# EAGLE design USB LiPo charger (EAGLE 5.06)
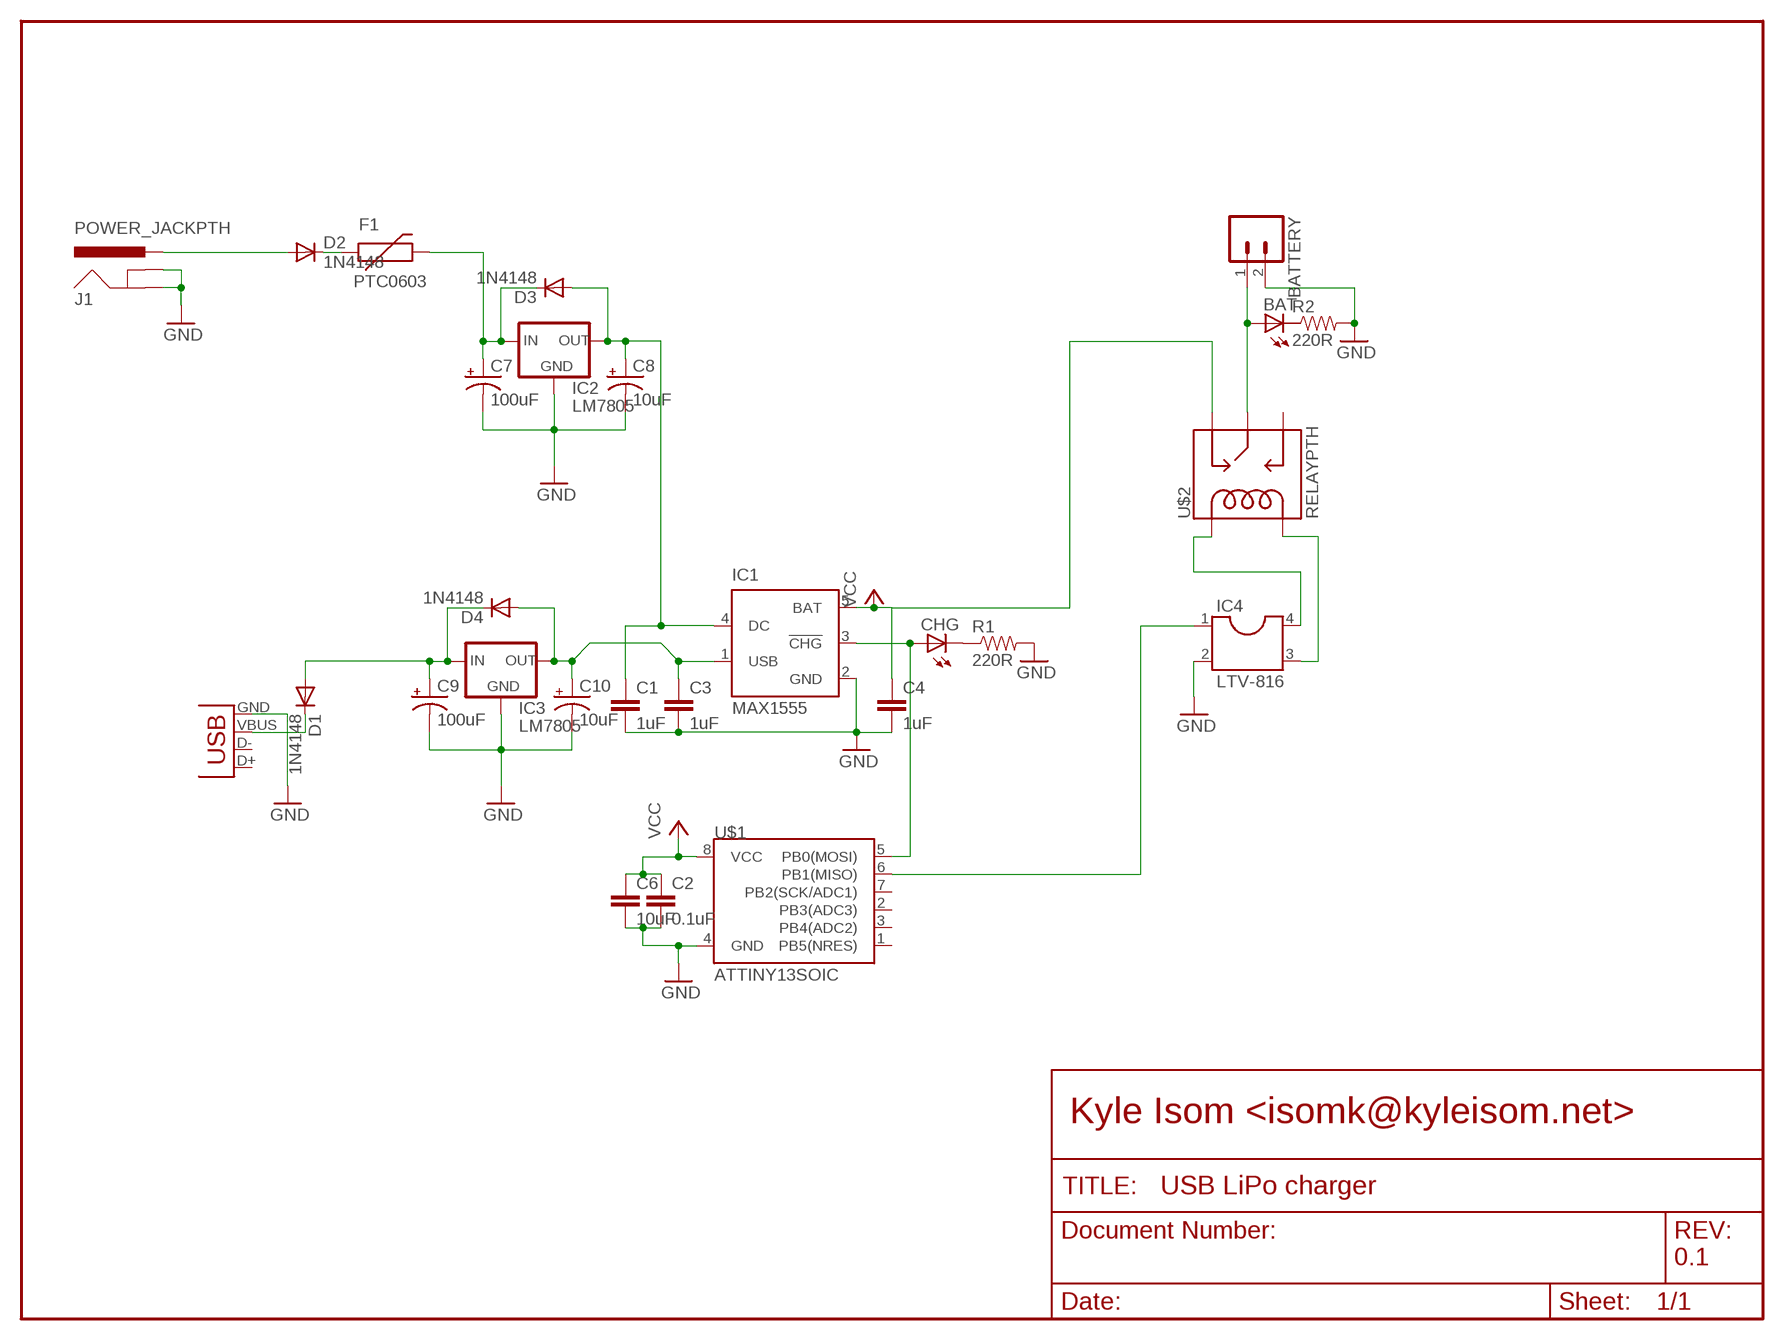
[diagram p0: schematic, sheet 1]

## Parts
BAT  LEDCHIP-LED0603  [CHIP-LED0603]
BATTERY  M02-JST-2MM-SMT  [S2B-PH]
C1  1uF  CAP0603-CAP  [0603-CAP]
C2  0.1uF  CAP0603-CAP  [0603-CAP]
C3  1uF  CAP0603-CAP  [0603-CAP]
C4  1uF  CAP0603-CAP  [0603-CAP]
C6  10uF  CAP0603-CAP  [0603-CAP]
C7  100uF  CAP_POL1206  [EIA3216]
C8  10uF  CAP_POL1206  [EIA3216]
C9  100uF  CAP_POL1206  [EIA3216]
C10  10uF  CAP_POL1206  [EIA3216]
CHG  LEDCHIP-LED0603  [CHIP-LED0603]
D1  1N4148  DIODESOD  [SOD-323]
D2  1N4148  DIODESOD  [SOD-323]
D3  1N4148  DIODE-SOD323-W  [SOD323-W]
D4  1N4148  DIODESOD  [SOD-323]
F1  PTC0603  [0603]
IC1  MAX1555  [SOT23-5L]
IC2  LM7805  V_REG_78XXSINK  [TO220-IGO]
IC3  LM7805  V_REG_78XXSINK  [TO220-IGO]
IC4  LTV-816  DIL4  [DIL04]
J1  POWER_JACKPTH  [POWER_JACK_PTH]
R1  220R  RESISTOR0603-RES  [0603-RES]
R2  220R  RESISTOR0603-RES  [0603-RES]
U$1  ATTINY13SOIC  [SO08]
U$2  RELAYPTH  [RELAY-G5Q]
X1  USBSMD  [USB-MINIB]

## Nets
GND: BATTERY.2 C1.2 C2.2 C3.2 C4.2 C6.2 C7.C(-) C8.C(-) C9.C(-) C10.C(-) IC1.2(GND) IC2.GND IC3.GND IC4.2 J1.GND J1.GNDBREAK R1.2 R2.2 U$1.4(GND) X1.GND
N$1: D2.2(A) J1.PWR
N$2: C3.1 C10.A(+) D4.2(A) IC1.1(USB) IC3.OUT
N$3: D1.1(C) X1.VBUS
N$5: C7.A(+) D3.C F1.2 IC2.IN
N$6: D2.1(C) F1.1
N$7: C9.A(+) D1.2(A) D4.1(C) IC3.IN
N$8: C1.1 C8.A(+) D3.A IC1.4(DC) IC2.OUT
N$9: CHG.A IC1.3(!CHG) U$1.5(PB0(MOSI))
N$10: CHG.C R1.1
N$11: IC4.1 U$1.6(PB1(MISO))
N$12: IC4.4 U$2.5(COIL1)
N$13: IC4.3 U$2.1(COIL2)
N$14: BAT.A BATTERY.1 U$2.2(MAIN)
VCC: C2.1 C4.1 C6.1 IC1.5(BAT) U$1.8(VCC) U$2.4(NC)
Unconnected: BAT.C R2.1 U$1.1(PB5(NRES)) U$1.2(PB3(ADC3)) U$1.3(PB4(ADC2)) U$1.7(PB2(SCK/ADC1)) U$2.3(NO) X1.D+ X1.D-

## Notes on the sheet
- Kyle Isom <isomk@kyleisom.net>
- 0.1

## Library data of the parts
BAT CHG = led:LED: LED OSRAM: - CHIPLED LG R971, LG N971, LY N971, LG Q971, LY Q971, LO R971, LY R971 LH N974, LH R974 LS Q976, LO Q976, LY Q976 LO Q996 - Hyper CHIPLED LW Q18S LB Q993, LB Q99A, LB R99A - SideLED LS A670, LO A670, LY A670, LG A670, LP A670 LB A673, LV A673, LT A673, LW A673 LH A674 LY A675 LS A676, LA A676, LO A676, LY A676, LW A676 LS A679, LY A679, LG A679 - Hyper Micro SIDELED® LS Y876, LA Y876, LO Y876, LY Y876 LT Y87S - SmartLED LW L88C, LW L88S LB L89C, LB L89S, LG L890 LS L89K, LO L89K, LY L89K LS L896, LA L896, LO L896, LY L896 - TOPLED LS T670, LO T670, LY T670, LG T670, LP T670 LSG T670, LSP T670, LSY T670, LOP T670, LYG T670 LG T671, LOG T671, LSG T671 LB T673, LV T673, LT T673, LW T673 LH T674 LS T676, LA T676, LO T676, LY T676, LB T676, LH T676, LSB T676, LW T676 LB T67C, LV T67C, LT T67C, LS T67K, LO T67K, LY T67K, LW E67C LS E67B, LA E67B, LO E67B, LY E67B, LB E67C, LV E67C, LT E67C LW T67C LS T679, LY T679, LG T679 LS T770, LO T770, LY T770, LG T770, LP T770 LB T773, LV T773, LT T773, LW T773 LH T774 LS E675, LA E675, LY E675, LS T675 LS T776, LA T776, LO T776, LY T776, LB T776 LHGB T686 LT T68C, LB T68C - Hyper Mini TOPLED® LB M676 - Mini TOPLED Santana® LG M470 LS M47K, LO M47K, LY M47K Source: http://www.osram.convergy.de LUXEON: - LUMILED® LXK2-PW12-R00, LXK2-PW12-S00, LXK2-PW14-U00, LXK2-PW14-V00 LXK2-PM12-R00, LXK2-PM12-S00, LXK2-PM14-U00 LXK2-PE12-Q00, LXK2-PE12-R00, LXK2-PE12-S00, LXK2-PE14-T00, LXK2-PE14-U00 LXK2-PB12-K00, LXK2-PB12-L00, LXK2-PB12-M00, LXK2-PB14-N00, LXK2-PB14-P00, LXK2-PB14-Q00 LXK2-PR12-L00, LXK2-PR12-M00, LXK2-PR14-Q00, LXK2-PR14-R00 LXK2-PD12-Q00, LXK2-PD12-R00, LXK2-PD12-S00 LXK2-PH12-R00, LXK2-PH12-S00 LXK2-PL12-P00, LXK2-PL12-Q00, LXK2-PL12-R00 Source: www.luxeon.com KINGBRIGHT: KA-3528ASYC Source: www.kingbright.com
BATTERY = SparkFun:M02: Header 2 Standard 2-pin 0.1" header. Use with straight break away headers (SKU : PRT-00116), right angle break away headers (PRT-00553), swiss pins (PRT-00743), machine pins (PRT-00117), and female headers (PRT-00115). Molex polarized connector foot print use with SKU : PRT-08233 with associated crimp pins and housings.
C1-C4 C6 = SparkFun:CAP: Capacitor Standard 0603 ceramic capacitor, and 0.1" leaded capacitor.
C7-C10 = SparkFun:CAP_POL: Capacitor Polarized These are standard SMD and PTH capacitors. Normally 10uF, 47uF, and 100uF in electrolytic and tantalum varieties. Always verify the external diameter of the through hole cap, it varies with capacity, voltage, and manufacturer. The EIA devices should be standard.
D1 D2 D4 = SparkFun:DIODE: Diode These are standard reverse protection diodes and small signal diodes. SMA package can handle up to about 1A. SOD-323 can handle about 200mA. What the SOD-323 package when ordering, there are some mfgs out there that are 5-pin packages.
D3 = diode:DIODE-: DIODE
F1 = SparkFun:PTC: Resettable Fuse PTC Resettable Fuse. Spark Fun Electronics SKU : COM-08357
IC1 = maxim:MAX1555: Dual-Input USB/AC Adapter 1-Cell Li+ Battery Chargers Source: http://www.maxim-ic.com .. MAX1551-MAX1555.pdf
IC2 IC3 = SparkFun:V_REG_78XX: Voltage Regulator Standard 7805 5V regulator. IGO (Input Ground Output). Spark Fun Electronics SKU : COM-00107
IC4 = ic-package:DIL4: Dual In Line / Socket
J1 = SparkFun:POWER_JACK: Power Jack This is the standard 5.5mm barrel jack for power. The PTH is the most common, proven, reliable, footprint. All others are experimental. The Slot footprint only works if the mill layer is transmitted to the PCB fab house so be warned. Spark Fun Electronics SKU : PRT-00119. Mating wall wart : TOL-00298 (and others)
R1 R2 = SparkFun:RESISTOR: Resistor Basic schematic elements and footprints for 0603, 1206, and PTH 1/10th watt (small) resistors.
U$1 = SparkFun:ATTINY13
U$2 = SparkFun:RELAY
X1 = SparkFun:USB: USB Connectors USB-B-PTH is fully proven SKU : PRT-00139 USB-miniB is fully proven SKU : PRT-00587 USB-A-PCB is untested. USB-A-H is throughly reviewed, but untested. Spark Fun Electronics SKU : PRT-00437 USB-B-SMT is throughly reviewed, but untested. Needs silkscreen touching up. USB-A-S has not been used/tested USB-MB-H has not been used/tested

## Board
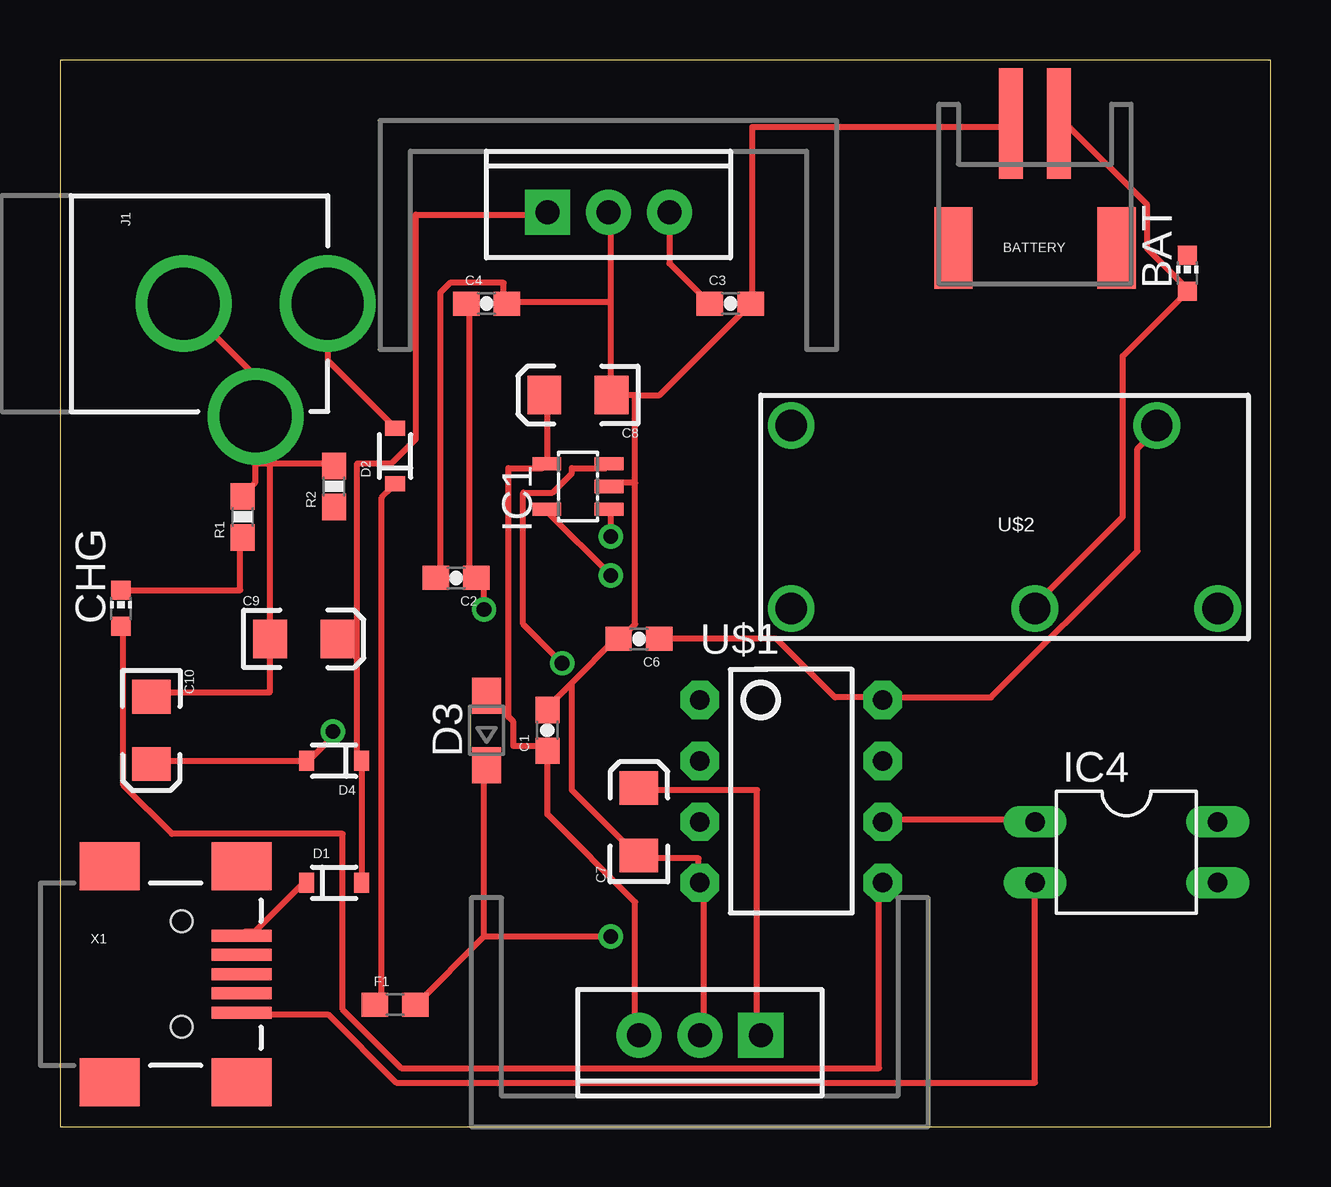
[diagram p1: board, top side]
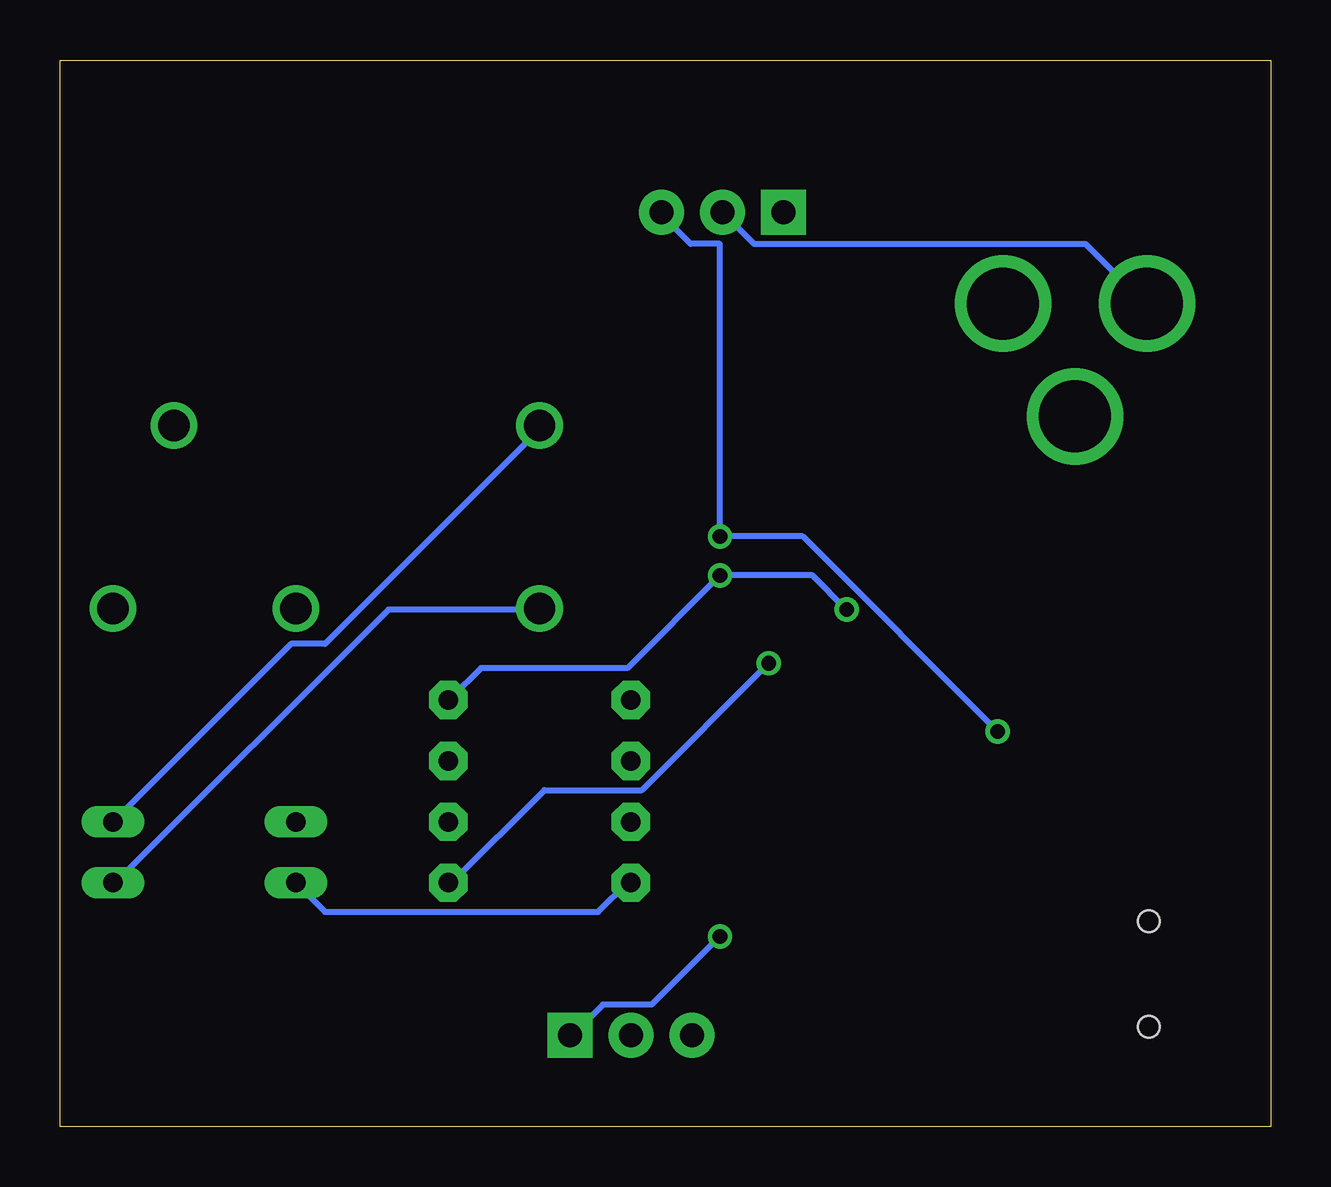
[diagram p2: board, bottom side, seen from below]

Size 50.47 x 44.44 mm. Coordinates in mm from the lower left corner, seen from the top.
Outline: 0,0 50.47,0 50.47,44.44 0,44.44 0,0
Copper layers (1*16): Top 0.035mm / dielectric 1.5mm / Bottom 0.035mm
Design rules "default": minimum track width 10mil, minimum drill 24mil, track to track 8mil, track to pad 8mil, pad to pad 8mil, via to via 8mil, smd to smd 8mil, copper to edge 40mil, drill to drill 8mil, minimum pad ring 10mil, minimum via ring 8mil, stop-mask expansion 4mil, vias tented up to drill 0mil, thermal gap 10mil

### Footprints (pad centres in the part's own frame; a part is rotated, then mirrored left to right if it is on the bottom)
CHIP-LED0603 = smd 0.8 x 0.8: A 0,-0.75; C 0,0.75
S2B-PH = smd 1 x 4.6: 1 -1,-3.7; 2 1,-3.7 | smd 1.6 x 3.4: NC1 -3.4,1.5; NC2 3.4,1.5
0603-CAP = smd 1.1 x 1: 1 -0.85,0; 2 0.85,0
EIA3216 = smd 1.4 x 1.6: A 1.4,0; C -1.4,0
SOD-323 = smd 0.63 x 0.83: 1 -1.15,0; 2 1.15,0
SOD323-W = smd 1.5 x 1.2: A 1.45,0; C -1.45,0
0603 = smd 1.1 x 1: 1 -0.85,0; 2 0.85,0
SOT23-5L = smd 0.55 x 1.2: 1 -0.95,-1.3; 2 0,-1.3; 3 0.95,-1.3; 4 0.95,1.3; 5 -0.95,1.3
TO220-IGO = drill 1 pad 1.88 round: GND 0,0; OUT 2.54,0 | drill 1 pad 1.88 square: IN -2.54,0
DIL04 = drill 0.813 long: 1 -1.27,-3.81; 2 1.27,-3.81; 3 1.27,3.81; 4 -1.27,3.81
POWER_JACK_PTH = drill 2.997 round: GND 0,7.7; GNDBREAK 4.7,10.7; PWR 0,13.7
0603-RES = smd 1.1 x 1: 1 -0.85,0; 2 0.85,0
DIP08 = drill 0.813 pad 1.6 octagon: 1 -3.81,-3.81; 2 -1.27,-3.81; 3 1.27,-3.81; 4 3.81,-3.81; 5 3.81,3.81; 6 1.27,3.81; 7 -1.27,3.81; 8 -3.81,3.81
RELAY-G5Q = drill 1.3 round: 1 8.89,3.81; 2 -1.27,3.81; 3 -8.89,3.81; 4 -6.35,-3.81; 5 8.89,-3.81
USB-MINIB = smd 2.5 x 0.5: D+ 2.5,0; D- 2.5,0.8; GND 2.5,-1.6; ID 2.5,-0.8; VBUS 2.5,1.6 | smd 2.5 x 2: GND@1 -3,-4.5; GND@2 -3,4.5; GND@3 2.5,4.5; GND@4 2.5,-4.5 | hole 0.9: 0,2.2; 0,-2.2

### Placement (x,y rotation side)
BAT  46.99,35.56 0 top
BATTERY  40.64,38.1 180 top
C1  20.32,16.51 90 top
C2  16.51,22.86 180 top
C3  27.94,34.29 0 top
C4  17.78,34.29 0 top
C6  24.13,20.32 180 top
C7  24.13,12.7 90 top
C8  21.59,30.48 180 top
C9  10.16,20.32 0 top
C10  3.81,16.51 270 top
CHG  2.54,21.59 0 top
D1  11.43,10.16 0 top
D2  13.97,27.94 90 top
D3  17.78,16.51 90 top
D4  11.43,15.24 180 top
F1  13.97,5.08 0 top
IC1  21.59,26.67 90 top
IC2  26.67,3.81 180 top
IC3  22.86,38.1 0 top
IC4  44.45,11.43 270 top
J1  -2.54,34.29 270 top
R1  7.62,25.4 90 top
R2  11.43,26.67 90 top
U$1  ATTINY13DIP  [DIP08]  30.48,13.97 270 top
U$2  39.37,25.4 180 top
X1  5.08,6.35 0 top

### Tracks (layer width: path | path; a pad name or v marks a point on that pad's centre or on a via)
GND
  Top 0.254: IC4.2 40.64,1.83 14.02,1.83 11.18,4.67 7.72,4.67 X1.GND | 8.74,20.32 8.74,18.09 3.86,18.09 C10.C | 8.13,27.64 8.13,29.46 J1.GNDBREAK | 8.13,27.64 8.13,26.82 7.72,26.42 R1.2 | 8.13,27.64 8.74,27.64 | 8.74,27.64 11.38,27.64 R2.2 | J1.GNDBREAK 8.13,27.64 | 8.74,27.64 8.74,20.32 | 8.74,20.32 C9.C | J1.GNDBREAK 8.74,27.64 | J1.GND 5.28,34.14 8.13,31.29 8.13,29.67 J1.GNDBREAK | IC2.GND 26.82,3.86 26.82,10.16 U$1.4 26.62,10.16 26.62,11.18 24.18,11.18 C7.C 23.98,11.38 21.34,14.02 21.34,18.49 | C2.2 15.85,22.96 15.85,34.75 16.26,35.15 18.49,35.15 18.49,34.34 C4.2 18.69,34.34 22.96,34.34 | 21.34,18.49 23.16,20.32 C6.2 23.37,20.32 23.98,20.93 23.98,26.82 | 21.34,18.49 20.32,17.48 C1.2 | 23.98,30.48 24.99,30.48 28.65,34.14 C3.2 28.85,34.34 28.85,41.66 39.62,41.66 BATTERY.2 | 23.98,30.48 C8.C 22.96,30.48 22.96,34.34 | 23.98,26.82 22.96,26.82 IC1.2 | 23.98,26.82 23.98,30.48 | 22.96,34.34 22.96,38 IC3.GND
  Bottom 0.254: J1.GND 5.28,34.34 7.72,36.78 21.54,36.78 IC3.GND | IC4.2 39.42,8.94 28.04,8.94 26.82,10.16 U$1.4
N$1
  Top 0.254: D2.2 13.82,29.26 11.18,31.9 11.18,34.14 J1.PWR
N$2  (via drill 0.61)
  Top 0.254: C10.A 3.86,15.24 D4.2 10.36,15.24 11.38,16.26 v11.38,16.46 | C3.1 27.03,34.34 25.4,35.97 IC3.OUT | v22.96,24.59 22.96,25.6 IC1.1
  Bottom 0.254: IC3.OUT 25.4,38 24.18,36.78 22.96,36.78 v22.96,24.59 19.51,24.59 v11.38,16.46
N$3
  Top 0.254: D1.1 10.16,10.16 8.13,8.13 7.72,8.13 X1.VBUS
N$5  (via drill 0.61)
  Top 0.254: 17.68,7.92 14.83,5.08 F1.2 | 17.68,7.92 17.68,15.04 D3.C | C7.A 24.18,14.02 29.06,14.02 29.06,3.86 IC2.IN | 17.68,7.92 v22.96,7.92
  Bottom 0.254: v22.96,7.92 25.81,5.08 27.84,5.08 29.06,3.86 IC2.IN
N$6
  Top 0.254: D2.1 13.82,26.62 13.41,26.21 13.41,5.28 13.21,5.08 F1.1
N$7
  Top 0.254: D1.2 12.6,10.16 12.6,15.24 D4.1 12.39,15.24 12.39,19.51 | 12.39,19.51 11.58,20.32 C9.A | 12.39,19.51 12.39,27.64 13.82,27.64 14.83,28.65 14.83,38 20.32,38 IC3.IN
N$8
  Top 0.254: C8.A 20.32,30.48 20.32,27.64 IC1.4 20.12,27.43 18.69,27.43 18.69,17.07 | 18.69,17.07 17.88,17.88 D3.A | 18.69,17.07 18.9,16.87 18.9,15.85 20.32,15.85 C1.1 20.32,13.01 23.98,9.35 23.98,3.86 IC2.OUT
N$9  (via drill 0.61)
  Top 0.254: CHG.A 2.64,20.73 2.64,14.22 4.67,12.19 11.79,12.19 11.79,4.88 14.22,2.44 34.14,2.44 34.14,10.16 U$1.5 | v20.93,19.3 19.3,20.93 19.3,26.42 20.52,26.42 21.34,27.23 21.34,27.43 22.76,27.43 IC1.3
  Bottom 0.254: v20.93,19.3 26.21,14.02 30.28,14.02 34.14,10.16 U$1.5
N$10
  Top 0.254: CHG.C 2.64,22.35 7.52,22.35 7.52,24.38 R1.1
N$11
  Top 0.254: IC4.1 40.64,12.8 34.34,12.8 U$1.6
N$12
  Bottom 0.254: IC4.4 40.84,20.12 39.42,20.12 30.48,29.06 U$2.5
N$13
  Bottom 0.254: IC4.3 48.16,10.16 36.78,21.54 30.48,21.54 U$2.1
N$14
  Top 0.254: BATTERY.1 41.66,41.66 42.06,41.66 45.31,38.41 45.31,36.58 46.94,34.95 BAT.A 46.94,34.75 44.3,32.11 44.3,25.4 40.64,21.74 U$2.2
VCC  (via drill 0.61)
  Top 0.254: C4.1 17.07,34.14 17.07,23.16 17.27,22.96 C2.1 17.48,22.76 17.68,22.55 v17.68,21.54 | C6.1 29.87,20.32 32.31,17.88 34.14,17.88 U$1.8 34.34,17.88 38.81,17.88 44.91,23.98 44.91,28.25 45.72,29.06 U$2.4 | v22.96,22.96 20.32,25.6 IC1.5
  Bottom 0.254: U$1.8 34.14,17.88 32.92,19.1 26.82,19.1 v22.96,22.96 19.1,22.96 v17.68,21.54